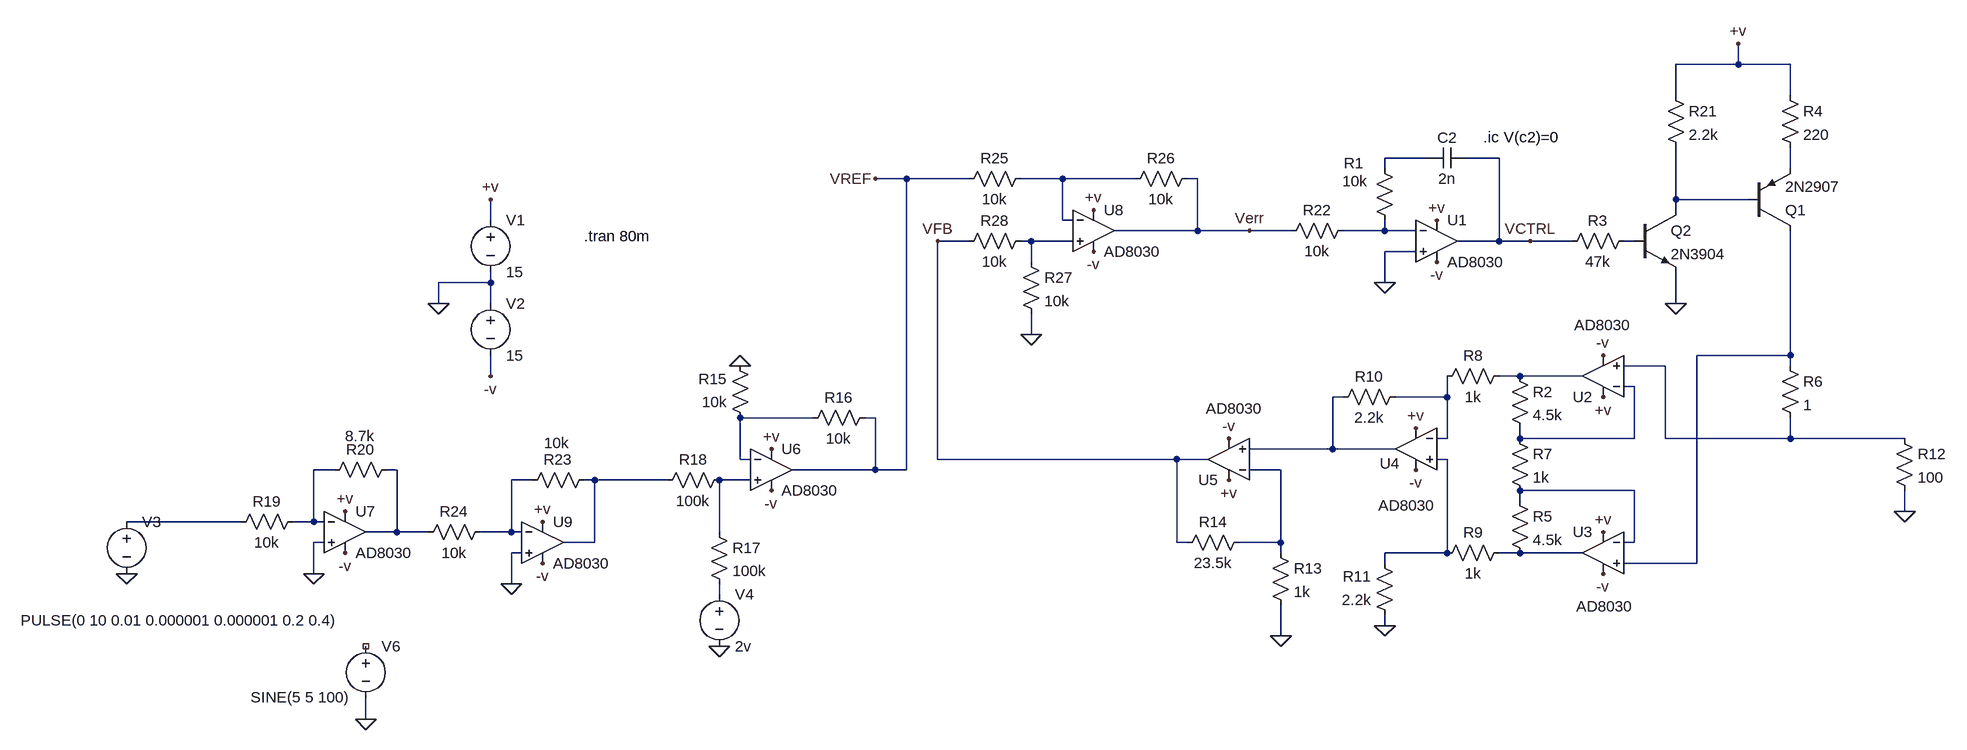
[diagram p0: schematic 4_20ma.asc]
4_20ma.asc, the LTspice schematic file:
Version 4
SHEET 1 2432 772
WIRE 1136 -256 1136 -288
WIRE 1136 -256 1040 -256
WIRE 1216 -256 1136 -256
WIRE 1040 -208 1040 -256
WIRE 1216 -208 1216 -256
WIRE 656 -112 592 -112
WIRE 768 -112 720 -112
WIRE 592 -96 592 -112
WIRE 1216 -96 1216 -128
WIRE -144 -80 -192 -80
WIRE -48 -80 -144 -80
WIRE 96 -80 32 -80
WIRE 208 -80 96 -80
WIRE 304 -80 288 -80
WIRE 1040 -48 1040 -128
WIRE 1152 -48 1040 -48
WIRE 1040 -32 1040 -48
WIRE -784 -16 -784 -48
WIRE 96 -16 96 -80
WIRE 112 -16 96 -16
WIRE 304 0 304 -80
WIRE 304 0 176 0
WIRE 384 0 304 0
WIRE 448 0 384 0
WIRE 592 0 592 -16
WIRE 592 0 528 0
WIRE 640 0 592 0
WIRE -48 16 -96 16
WIRE 48 16 32 16
WIRE 112 16 48 16
WIRE 768 16 768 -112
WIRE 768 16 704 16
WIRE 816 16 768 16
WIRE 880 16 816 16
WIRE 976 16 960 16
WIRE 640 32 592 32
WIRE 48 48 48 16
WIRE -784 80 -784 64
WIRE -784 80 -864 80
WIRE 592 80 592 32
WIRE -864 112 -864 80
WIRE -784 112 -784 80
WIRE 1040 112 1040 64
WIRE 48 160 48 128
WIRE 1216 192 1216 0
WIRE 1216 192 1072 192
WIRE 1024 208 960 208
WIRE 1216 208 1216 192
WIRE -784 224 -784 192
WIRE 800 224 768 224
WIRE 896 224 800 224
WIRE 976 240 960 240
WIRE 528 256 512 256
WIRE 688 256 688 224
WIRE 688 256 608 256
WIRE -288 288 -400 288
WIRE -192 288 -208 288
WIRE 688 320 688 256
WIRE 688 320 672 320
WIRE 800 320 800 304
WIRE 976 320 976 240
WIRE 976 320 800 320
WIRE 1024 320 1024 208
WIRE 1216 320 1216 288
WIRE 1216 320 1024 320
WIRE 1392 320 1216 320
WIRE 512 336 512 256
WIRE 512 336 384 336
WIRE 608 336 512 336
WIRE -400 352 -400 288
WIRE -384 352 -400 352
WIRE -96 352 -96 16
WIRE 272 352 -96 352
WIRE 320 352 272 352
WIRE 688 352 672 352
WIRE -1024 368 -1056 368
WIRE -928 368 -944 368
WIRE -192 368 -192 288
WIRE -192 368 -320 368
WIRE -144 368 -144 -80
WIRE -144 368 -192 368
WIRE 432 368 384 368
WIRE -720 384 -752 384
WIRE -624 384 -640 384
WIRE -512 384 -624 384
WIRE -384 384 -432 384
WIRE 976 400 800 400
WIRE 800 416 800 400
WIRE 1392 432 1392 400
WIRE -1168 448 -1344 448
WIRE -1056 448 -1056 368
WIRE -1056 448 -1088 448
WIRE -1040 448 -1056 448
WIRE -928 464 -928 368
WIRE -928 464 -976 464
WIRE -880 464 -928 464
WIRE -752 464 -752 384
WIRE -752 464 -800 464
WIRE -736 464 -752 464
WIRE -432 464 -432 384
WIRE -1040 480 -1056 480
WIRE -624 480 -624 384
WIRE -624 480 -672 480
WIRE 272 480 272 352
WIRE 288 480 272 480
WIRE 432 480 432 368
WIRE 432 480 368 480
WIRE 976 480 976 400
WIRE 976 480 960 480
WIRE -736 496 -752 496
WIRE 432 496 432 480
WIRE 688 496 688 352
WIRE 688 496 592 496
WIRE 800 496 768 496
WIRE 896 496 800 496
WIRE 592 512 592 496
WIRE 1072 512 1072 192
WIRE 1072 512 960 512
WIRE -1056 528 -1056 480
WIRE -752 544 -752 496
WIRE -432 560 -432 544
WIRE 592 608 592 592
WIRE 432 624 432 576
WIRE -976 752 -976 720
FLAG -864 112 0
FLAG -784 -48 +v
FLAG -784 224 -v
FLAG 1136 -288 +v
FLAG 672 -16 +v
FLAG 928 256 +v
FLAG 928 192 -v
FLAG 672 48 -v
FLAG 928 464 +v
FLAG 928 528 -v
FLAG 640 304 +v
FLAG 640 368 -v
FLAG 592 608 0
FLAG 1392 432 0
FLAG 352 384 +v
FLAG 352 320 -v
FLAG 432 624 0
FLAG -352 336 +v
FLAG -352 400 -v
FLAG -432 640 0
FLAG -400 208 0
FLAG -1008 432 +v
FLAG -1008 496 -v
FLAG -976 752 0
FLAG -1056 528 0
FLAG -704 448 +v
FLAG -704 512 -v
FLAG -752 544 0
FLAG 1040 112 0
FLAG -96 16 VFB
FLAG 816 16 VCTRL
FLAG -192 -80 VREF
FLAG 144 -32 +v
FLAG 144 32 -v
FLAG 48 160 0
FLAG 592 80 0
FLAG 384 0 Verr
FLAG -1344 528 0
SYMBOL voltage -784 -32 R0
WINDOW 123 0 0 Left 0
WINDOW 39 0 0 Left 0
SYMATTR InstName V1
SYMATTR Value 15
SYMBOL voltage -784 96 R0
WINDOW 123 0 0 Left 0
WINDOW 39 0 0 Left 0
SYMATTR InstName V2
SYMATTR Value 15
SYMBOL Opamps\\AD8030 672 -48 R0
SYMATTR InstName U1
SYMBOL res 976 0 R90
WINDOW 0 0 56 VBottom 2
WINDOW 3 32 56 VTop 2
SYMATTR InstName R3
SYMATTR Value 47k
SYMBOL res 1200 -224 R0
SYMATTR InstName R4
SYMATTR Value 220
SYMBOL res 1200 192 R0
SYMATTR InstName R6
SYMATTR Value 1
SYMBOL Opamps\\AD8030 928 288 R180
WINDOW 3 -43 143 Left 2
SYMATTR InstName U2
SYMBOL Opamps\\AD8030 928 432 M0
WINDOW 3 -46 146 Left 2
SYMATTR InstName U3
SYMBOL res 784 208 R0
SYMATTR InstName R2
SYMATTR Value 4.5k
SYMBOL res 784 400 R0
SYMATTR InstName R5
SYMATTR Value 4.5k
SYMBOL res 784 304 R0
SYMATTR InstName R7
SYMATTR Value 1k
SYMBOL res 784 208 R90
WINDOW 0 0 56 VBottom 2
WINDOW 3 32 56 VTop 2
SYMATTR InstName R8
SYMATTR Value 1k
SYMBOL res 784 480 R90
WINDOW 0 0 56 VBottom 2
WINDOW 3 32 56 VTop 2
SYMATTR InstName R9
SYMATTR Value 1k
SYMBOL Opamps\\AD8030 640 272 M0
WINDOW 0 25 86 Left 2
WINDOW 3 -29 151 Left 2
SYMATTR InstName U4
SYMBOL res 624 240 R90
WINDOW 0 0 56 VBottom 2
WINDOW 3 32 56 VTop 2
SYMATTR InstName R10
SYMATTR Value 2.2k
SYMBOL res 608 608 R180
WINDOW 0 36 76 Left 2
WINDOW 3 36 40 Left 2
SYMATTR InstName R11
SYMATTR Value 2.2k
SYMBOL res 1376 304 R0
SYMATTR InstName R12
SYMATTR Value 100
SYMBOL Opamps\\AD8030 352 416 R180
WINDOW 3 -52 142 Left 2
SYMATTR InstName U5
SYMBOL res 416 480 R0
SYMATTR InstName R13
SYMATTR Value 1k
SYMBOL res 384 464 R90
WINDOW 0 0 56 VBottom 2
WINDOW 3 32 56 VTop 2
SYMATTR InstName R14
SYMATTR Value 23.5k
SYMBOL Opamps\\AD8030 -352 304 R0
SYMATTR InstName U6
SYMBOL res -384 304 R180
WINDOW 0 36 76 Left 2
WINDOW 3 36 40 Left 2
SYMATTR InstName R15
SYMATTR Value 10k
SYMBOL res -304 304 R270
WINDOW 0 32 56 VTop 2
WINDOW 3 0 56 VBottom 2
SYMATTR InstName R16
SYMATTR Value 10k
SYMBOL res -448 448 R0
SYMATTR InstName R17
SYMATTR Value 100k
SYMBOL res -416 368 R90
WINDOW 0 0 56 VBottom 2
WINDOW 3 32 56 VTop 2
SYMATTR InstName R18
SYMATTR Value 100k
SYMBOL voltage -432 544 R0
WINDOW 123 0 0 Left 0
WINDOW 39 0 0 Left 0
SYMATTR InstName V4
SYMATTR Value 2v
SYMBOL Opamps\\AD8030 -1008 400 R0
SYMATTR InstName U7
SYMBOL voltage -976 624 R0
WINDOW 123 0 0 Left 0
WINDOW 39 0 0 Left 0
WINDOW 3 -177 94 Left 2
SYMATTR Value SINE(5 5 100)
SYMATTR InstName V6
SYMBOL res -1072 432 R90
WINDOW 0 0 56 VBottom 2
WINDOW 3 32 56 VTop 2
SYMATTR InstName R19
SYMATTR Value 10k
SYMBOL res -928 352 R90
WINDOW 0 0 56 VBottom 2
WINDOW 3 -52 57 VTop 2
SYMATTR InstName R20
SYMATTR Value 8.7k
SYMBOL Opamps\\AD8030 -704 416 R0
SYMATTR InstName U9
SYMBOL res -624 368 R90
WINDOW 0 0 56 VBottom 2
WINDOW 3 -57 58 VTop 2
SYMATTR InstName R23
SYMATTR Value 10k
SYMBOL res -784 448 R90
WINDOW 0 0 56 VBottom 2
WINDOW 3 32 56 VTop 2
SYMATTR InstName R24
SYMATTR Value 10k
SYMBOL cap 720 -128 R90
WINDOW 0 0 32 VBottom 2
WINDOW 3 32 32 VTop 2
SYMATTR InstName C2
SYMATTR Value 2n
SYMBOL pnp 1152 0 M180
SYMATTR InstName Q1
SYMATTR Value 2N2907
SYMBOL npn 976 -32 R0
SYMATTR InstName Q2
SYMATTR Value 2N3904
SYMBOL res 1024 -224 R0
SYMATTR InstName R21
SYMATTR Value 2.2k
SYMBOL res 576 -112 R0
WINDOW 0 -47 8 Left 2
WINDOW 3 -49 36 Left 2
SYMATTR InstName R1
SYMATTR Value 10k
SYMBOL Opamps\\AD8030 144 -64 R0
SYMATTR InstName U8
SYMBOL res 48 -96 R90
WINDOW 0 0 56 VBottom 2
WINDOW 3 32 56 VTop 2
SYMATTR InstName R25
SYMATTR Value 10k
SYMBOL res 192 -64 R270
WINDOW 0 32 56 VTop 2
WINDOW 3 0 56 VBottom 2
SYMATTR InstName R26
SYMATTR Value 10k
SYMBOL res 48 0 R90
WINDOW 0 0 56 VBottom 2
WINDOW 3 32 56 VTop 2
SYMATTR InstName R28
SYMATTR Value 10k
SYMBOL res 32 32 R0
SYMATTR InstName R27
SYMATTR Value 10k
SYMBOL res 544 -16 R90
WINDOW 0 0 56 VBottom 2
WINDOW 3 32 56 VTop 2
SYMATTR InstName R22
SYMATTR Value 10k
SYMBOL voltage -1344 432 R0
WINDOW 3 -163 168 Left 2
WINDOW 123 0 0 Left 0
WINDOW 39 0 0 Left 0
SYMATTR InstName V3
SYMATTR Value PULSE(0 10 0.01 0.000001 0.000001 0.2 0.4)
TEXT -640 8 Left 2 !.tran 80m
TEXT 744 -144 Left 2 !.ic V(c2)=0

The netlist it stands for:
* 4_20ma.asc
V1 +v 0 15
V2 0 -v 15
XU1 0 N005 +v -v VCTRL AD8040  ; AD8030, pins In+ In- V+ V- OUT
R3 N007 VCTRL 47k
R4 +v N002 220
R6 N008 N009 1
XU2 N009 N011 +v -v N010 AD8040  ; AD8030, pins In+ In- V+ V- OUT
XU3 N008 N022 +v -v N024 AD8040  ; AD8030, pins In+ In- V+ V- OUT
R2 N010 N011 4.5k
R5 N022 N024 4.5k
R7 N011 N022 1k
R8 N010 N013 1k
R9 N024 N015 1k
XU4 N015 N013 +v -v N012 AD8040  ; AD8030, pins In+ In- V+ V- OUT
R10 N013 N012 2.2k
R11 0 N015 2.2k
R12 N009 0 100
XU5 N012 N018 +v -v VFB AD8040  ; AD8030, pins In+ In- V+ V- OUT
R13 N018 0 1k
R14 N018 VFB 23.5k
XU6 N021 N014 +v -v VREF AD8040  ; AD8030, pins In+ In- V+ V- OUT
R15 N014 0 10k
R16 N014 VREF 10k
R17 N021 N025 100k
R18 N021 N020 100k
V4 N025 0 2v
XU7 0 N016 +v -v N017 AD8040  ; AD8030, pins In+ In- V+ V- OUT
V6 NC_01 0 SINE(5 5 100)
R19 N016 N023 10k
R20 N017 N016 8.7k
XU9 0 N019 +v -v N020 AD8040  ; AD8030, pins In+ In- V+ V- OUT
R23 N020 N019 10k
R24 N019 N017 10k
C2 VCTRL N001 2n
Q1 N008 N004 N002 0 2N2907
Q2 N004 N007 0 0 2N3904
R21 +v N004 2.2k
R1 N001 N005 10k
XU8 N006 N003 +v -v Verr AD8040  ; AD8030, pins In+ In- V+ V- OUT
R25 N003 VREF 10k
R26 N003 Verr 10k
R28 N006 VFB 10k
R27 N006 0 10k
R22 N005 Verr 10k
V3 N023 0 PULSE(0 10 0.01 0.000001 0.000001 0.2 0.4)
.model NPN NPN
.model PNP PNP
.lib standard.bjt
.tran 80m
.ic V(c2)=0
.lib ADI.lib
.backanno
.end